# EAGLE schematic FT232RL (EAGLE 7.7.0)
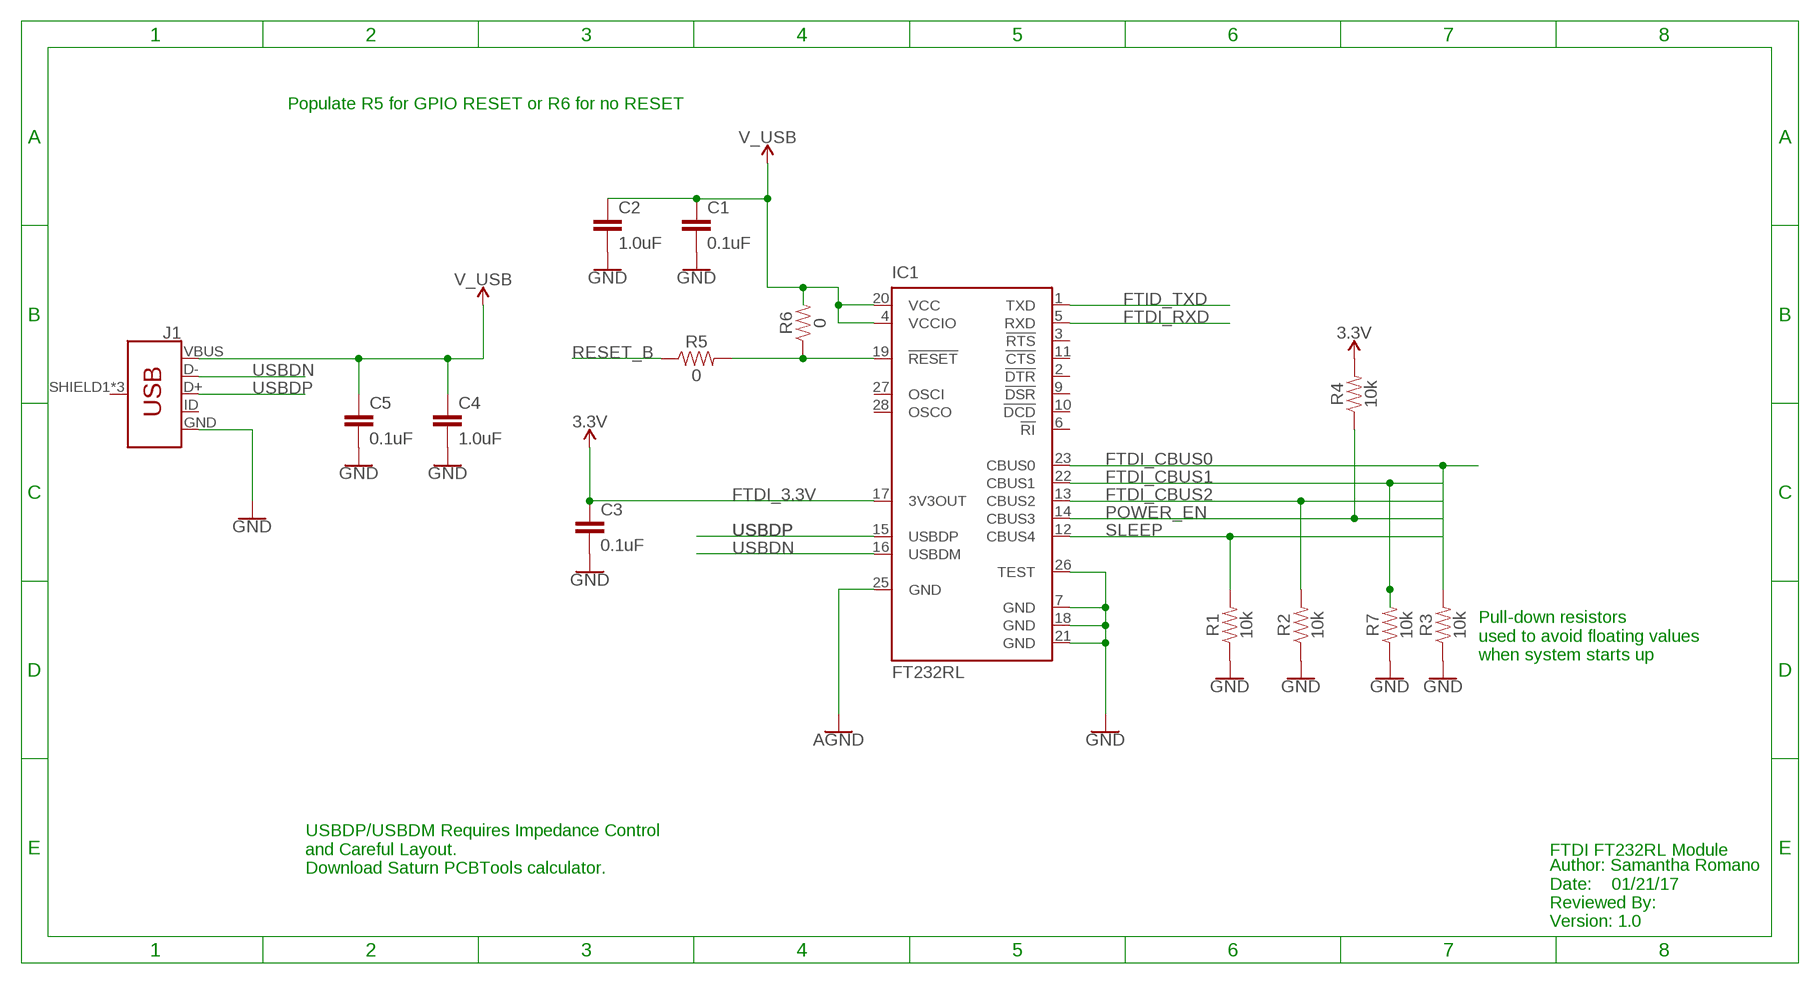
[diagram p0: schematic, sheet 1]

## Parts
C1  0.1uF  0.1UF-0603-25V-5%  [0603]
C2  1.0uF  1.0UF-0603-16V-10%  [0603]
C3  0.1uF  0.1UF-0603-25V-5%  [0603]
C4  1.0uF  1.0UF-0603-16V-10%  [0603]
C5  0.1uF  0.1UF-0603-25V-5%  [0603]
IC1  FT232RL  [SSOP28]
J1  USB_MICRO-B_FEMALE-SMT  [USB-B-MICRO-SMD]
R1  10k  10KOHM-0603-1/10W-1%  [0603]
R2  10k  10KOHM-0603-1/10W-1%  [0603]
R3  10k  10KOHM-0603-1/10W-1%  [0603]
R4  10k  10KOHM-0603-1/10W-1%  [0603]
R5  0  0OHM-0603-1/10W-5%  [0603]
R6  0  0OHM-0603-1/10W-5%  [0603]
R7  10k  10KOHM-0603-1/10W-1%  [0603]

## Nets
3.3V: R4.2
AGND: IC1.25(GND)
FTDI_3.3V: C3.1 IC1.17(3V3OUT) ; supply symbol labelled 3.3V
FTDI_CBUS0: IC1.23(CBUS0) R3.2
FTDI_CBUS1: IC1.22(CBUS1) R7.2
FTDI_CBUS2: IC1.13(CBUS2) R2.2
FTDI_RXD: IC1.5(RXD)
FTID_TXD: IC1.1(TXD)
GND: C1.2 C2.2 C3.2 C4.2 C5.2 IC1.7(GND) IC1.18(GND) IC1.21(GND) IC1.26(TEST) R1.1 R2.1 R3.1 R7.1
N$1: IC1.19(!RESET) R5.2 R6.1
POWER_EN: IC1.14(CBUS3) R4.1
RESET_B: R5.1
SLEEP: IC1.12(CBUS4) R1.2
USB_GND: J1.GND ; supply symbol labelled GND
USBDN: IC1.16(USBDM) J1.D-
USBDP: IC1.15(USBDP) J1.D+
V_USB: C1.1 C2.1 C4.1 C5.1 IC1.4(VCCIO) IC1.20(VCC) J1.VBUS
Unconnected: IC1.2(!DTR) IC1.3(!RTS) IC1.6(!RI) IC1.9(!DSR) IC1.10(!DCD) IC1.11(!CTS) IC1.27(OSCI) IC1.28(OSCO) J1.ID J1.SHIELD1(SHIELD) J1.SHIELD2(SHIELD) J1.SHIELD3(SHIELD) R6.2

## Notes on the sheet
- Populate R5 for GPIO RESET or R6 for no RESET
- Pull-down resistors 
  used to avoid floating values
  when system starts up
- FTDI FT232RL Module
- USBDP/USBDM Requires Impedance Control
  and Careful Layout. 
  Download Saturn PCBTools calculator.
- Author: Samantha Romano
  Date:    01/21/17
  Reviewed By:
  Version: 1.0

## Library data of the parts
C1 C3 C5 = SparkFun-Capacitors:0.1UF: 0.1µF ceramic capacitors A capacitor is a passive two-terminal electrical component used to store electrical energy temporarily in an electric field.; PROD_ID: CAP-08604
C2 C4 = SparkFun-Capacitors:1.0UF: 1µF ceramic capacitors A capacitor is a passive two-terminal electrical component used to store electrical energy temporarily in an electric field.; PROD_ID: CAP-00868
IC1 = ftdichip:FT232R: Source: http://www.ftdichip.com/Documents/DataSheets/DS_FT232R_v104.pdf; MPN: FT232RL; OC_FARNELL: 1146032; OC_NEWARK: 91K9918
J1 = SparkFun-Connectors:USB_MICRO-B: USB Type Micro-B Connector Male/female and PTH/SMT variants SparkFun Products: SparkFun microB USB Breakout <https://www.sparkfun.com/products/12035> SparkFun USB microB Plug Breakout <https://www.sparkfun.com/products/10031> SparkFun ESP8266 Thing <https://www.sparkfun.com/products/13231>; PROD_ID: CONN-11752
R1-R4 R7 = SparkFun-Resistors:10KOHM: 10kΩ resistor A resistor is a passive two-terminal electrical component that implements electrical resistance as a circuit element. Resistors act to reduce current flow, and, at the same time, act to lower voltage levels within circuits. - Wikipedia; PROD_ID: RES-00824
R5 R6 = SparkFun-Resistors:0OHM: 0Ω resistor A resistor is a passive two-terminal electrical component that implements electrical resistance as a circuit element. Resistors act to reduce current flow, and, at the same time, act to lower voltage levels within circuits. - Wikipedia; PROD_ID: RES-08609